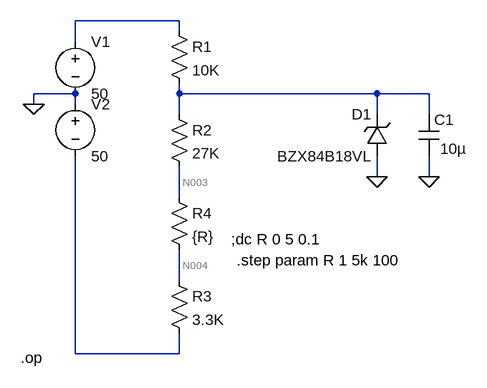
[diagram p0: schematic zener.asc]
zener.asc, the LTspice schematic file:
Version 4
SHEET 1 880 680
WIRE 96 32 -64 32
WIRE 96 48 96 32
WIRE -64 64 -64 32
WIRE -64 144 -128 144
WIRE 96 144 96 128
WIRE 400 144 96 144
WIRE 480 144 400 144
WIRE -128 160 -128 144
WIRE -64 160 -64 144
WIRE 96 176 96 144
WIRE 400 176 400 144
WIRE 480 176 480 144
WIRE 400 272 400 240
WIRE 480 272 480 240
WIRE 96 304 96 256
WIRE 96 432 96 384
WIRE -64 544 -64 240
WIRE 96 544 96 512
WIRE 96 544 -64 544
FLAG -128 160 0
FLAG 400 272 0
FLAG 480 272 0
SYMBOL res 80 32 R0
SYMATTR InstName R1
SYMATTR Value 10K
SYMBOL res 80 160 R0
SYMATTR InstName R2
SYMATTR Value 27K
SYMBOL zener 416 240 R180
WINDOW 0 24 64 Left 2
WINDOW 3 24 0 Left 2
SYMATTR InstName D1
SYMATTR Value BZX84B18VL
SYMATTR Description Diode
SYMATTR Type diode
SYMBOL cap 464 176 R0
WINDOW 3 33 53 Left 2
SYMATTR InstName C1
SYMATTR Value 10µ
SYMBOL res 80 416 R0
SYMATTR InstName R3
SYMATTR Value 3.3K
SYMBOL voltage -64 48 R0
WINDOW 123 0 0 Left 0
WINDOW 39 0 0 Left 0
SYMATTR InstName V1
SYMATTR Value 50
SYMBOL voltage -64 144 R0
WINDOW 123 0 0 Left 0
WINDOW 39 0 0 Left 0
SYMATTR InstName V2
SYMATTR Value 50
SYMBOL res 80 288 R0
SYMATTR InstName R4
SYMATTR Value {R}
TEXT 176 368 Left 2 !;dc R 0 5 0.1
TEXT 184 400 Left 2 !.step param R 1 5k 100
TEXT -148 550 Left 2 !.op

The netlist it stands for:
* zener.asc
R1 N001 N002 10K
R2 N002 N003 27K
D1 0 N002 BZX84B18VL
C1 N002 0 10µ
R3 N004 N005 3.3K
V1 N001 0 50
V2 0 N005 50
R4 N003 N004 {R}
.model D D
.lib standard.dio
;dc R 0 5 0.1
.step param R 1 5k 100
.op
.backanno
.end

* Results of the author's LTspice run, read from the files saved beside the schematic
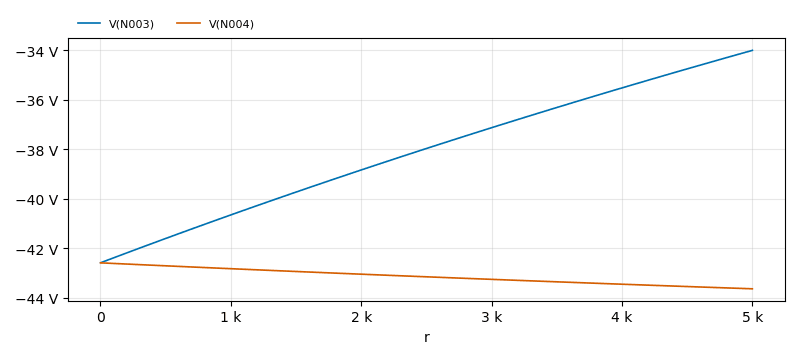
[diagram p1: Operating Point of zener.asc, plotted from the saved traces]
* Operating Point, 1 run:
*   V(N003): -42.59 V at r=1 , -34.01 V at r=5 k, min -42.59 V, max -34.01 V
*   V(N004): -42.6 V at r=1 , -43.64 V at r=5 k, min -43.64 V, max -42.6 V